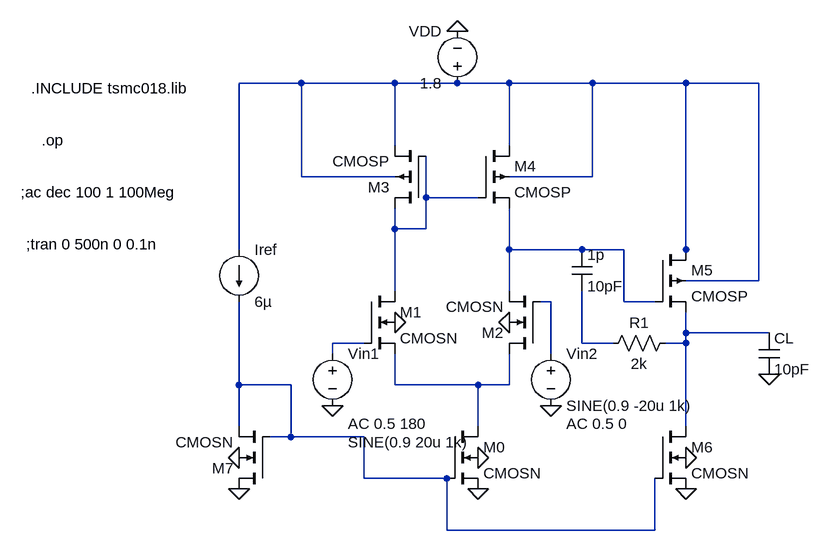
[diagram p0: schematic 2 stage OTA open loop design.asc]
2 stage OTA open loop design.asc, the LTspice schematic file:
Version 4
SHEET 1 880 788
WIRE -784 96 -880 96
WIRE -640 96 -784 96
WIRE -544 96 -640 96
WIRE -464 96 -544 96
WIRE -336 96 -464 96
WIRE -192 96 -336 96
WIRE -80 96 -192 96
WIRE -640 192 -640 96
WIRE -464 192 -464 96
WIRE -784 240 -784 96
WIRE -640 240 -784 240
WIRE -336 240 -336 96
WIRE -336 240 -464 240
WIRE -592 272 -592 208
WIRE -512 272 -592 272
WIRE -640 320 -640 288
WIRE -592 320 -592 272
WIRE -592 320 -640 320
WIRE -880 352 -880 96
WIRE -464 352 -464 288
WIRE -352 352 -464 352
WIRE -288 352 -352 352
WIRE -192 352 -192 96
WIRE -192 368 -192 352
WIRE -80 400 -80 96
WIRE -80 400 -192 400
WIRE -640 416 -640 320
WIRE -464 416 -464 352
WIRE -400 432 -416 432
WIRE -288 432 -288 352
WIRE -240 432 -288 432
WIRE -192 480 -192 448
WIRE -64 480 -192 480
WIRE -688 496 -736 496
WIRE -352 496 -352 416
WIRE -304 496 -352 496
WIRE -192 496 -192 480
WIRE -192 496 -224 496
WIRE -736 512 -736 496
WIRE -400 512 -400 432
WIRE -880 560 -880 432
WIRE -800 560 -880 560
WIRE -640 560 -640 512
WIRE -512 560 -640 560
WIRE -464 560 -464 512
WIRE -464 560 -512 560
WIRE -880 624 -880 560
WIRE -512 624 -512 560
WIRE -192 624 -192 496
WIRE -800 640 -800 560
WIRE -800 640 -832 640
WIRE -688 640 -800 640
WIRE -688 704 -688 640
WIRE -560 704 -688 704
WIRE -560 784 -560 704
WIRE -240 784 -240 704
WIRE -240 784 -560 784
FLAG -464 464 0
FLAG -640 464 0
FLAG -512 672 0
FLAG -512 720 0
FLAG -192 720 0
FLAG -192 672 0
FLAG -880 672 0
FLAG -64 544 0
FLAG -544 16 0
FLAG -736 592 0
FLAG -400 592 0
FLAG -880 720 0
SYMBOL cmosp -592 288 R180
SYMATTR InstName M3
SYMATTR Value2 l=0.36u w=5.4u
SYMBOL cmosp -240 352 R0
SYMATTR InstName M5
SYMATTR Value2 l=0.36u w=10.8u
SYMBOL cmosn -688 416 R0
SYMATTR InstName M1
SYMATTR Value2 l=0.36u w=2.35u
SYMBOL cmosn -416 512 R180
SYMATTR InstName M2
SYMATTR Value2 l=0.36u w=2.35u
SYMBOL cmosn -560 624 R0
SYMATTR InstName M0
SYMATTR Value2 l=0.36u w=4.68u
SYMBOL cmosn -240 624 R0
SYMATTR InstName M6
SYMATTR Value2 l=0.36u w=4.68u
SYMBOL cmosp -512 192 R0
SYMATTR InstName M4
SYMATTR Value2 l=0.36u w=5.4u
SYMBOL current -880 352 R0
WINDOW 123 0 0 Left 2
WINDOW 39 0 0 Left 2
SYMATTR InstName Iref
SYMATTR Value 6µ
SYMBOL cap -368 352 R0
SYMATTR InstName 1p
SYMATTR Value 10pF
SYMBOL res -208 480 R90
WINDOW 0 0 56 VBottom 2
WINDOW 3 32 56 VTop 2
SYMATTR InstName R1
SYMATTR Value 2k
SYMBOL cmosn -832 720 R180
SYMATTR InstName M7
SYMATTR Value2 l=0.36u w=0.47u
SYMBOL cap -80 480 R0
SYMATTR InstName CL
SYMATTR Value 10pF
SYMBOL voltage -544 112 R180
WINDOW 0 24 96 Left 2
WINDOW 3 24 16 Left 2
SYMATTR InstName VDD
SYMATTR Value 1.8
SYMBOL voltage -400 496 R0
WINDOW 123 24 124 Left 2
WINDOW 39 0 0 Left 2
SYMATTR Value2 AC 0.5 0
SYMATTR InstName Vin2
SYMATTR Value SINE(0.9 -20u 1k)
SYMBOL voltage -736 496 R0
WINDOW 3 24 152 Left 2
WINDOW 123 24 124 Left 2
WINDOW 39 0 0 Left 2
SYMATTR Value SINE(0.9 20u 1k)
SYMATTR Value2 AC 0.5 180
SYMATTR InstName Vin1
TEXT -1200 104 Left 2 !.INCLUDE tsmc018.lib
TEXT -1184 184 Left 2 !.op
TEXT -1216 264 Left 2 !;ac dec 100 1 100Meg
TEXT -1208 344 Left 2 !;tran 0 500n 0 0.1n

The netlist it stands for:
* 2 stage OTA open loop design.asc
M3 N002 N002 N001 N001 CMOSP l=0.36u w=5.4u
M5 N001 N003 N005 N001 CMOSP l=0.36u w=10.8u
M1 N002 N006 N009 0 CMOSN l=0.36u w=2.35u
M2 N009 N004 N003 0 CMOSN l=0.36u w=2.35u
M0 N009 N008 0 0 CMOSN l=0.36u w=4.68u
M6 N005 N008 0 0 CMOSN l=0.36u w=4.68u
M4 N001 N002 N003 N001 CMOSP l=0.36u w=5.4u
Iref N001 N008 6µ
C§1p N003 N007 10pF
R1 N005 N007 2k
M7 0 N008 N008 0 CMOSN l=0.36u w=0.47u
CL N005 0 10pF
VDD N001 0 1.8
Vin2 N004 0 SINE(0.9 -20u 1k) AC 0.5 0
Vin1 N006 0 SINE(0.9 20u 1k) AC 0.5 180
.model NMOS NMOS
.model PMOS PMOS
.lib standard.mos
.INCLUDE tsmc018.lib
.op
;ac dec 100 1 100Meg
;tran 0 500n 0 0.1n
.backanno
.end